# Altium schematic sheet EstmetSquematic.SchDoc
size A4
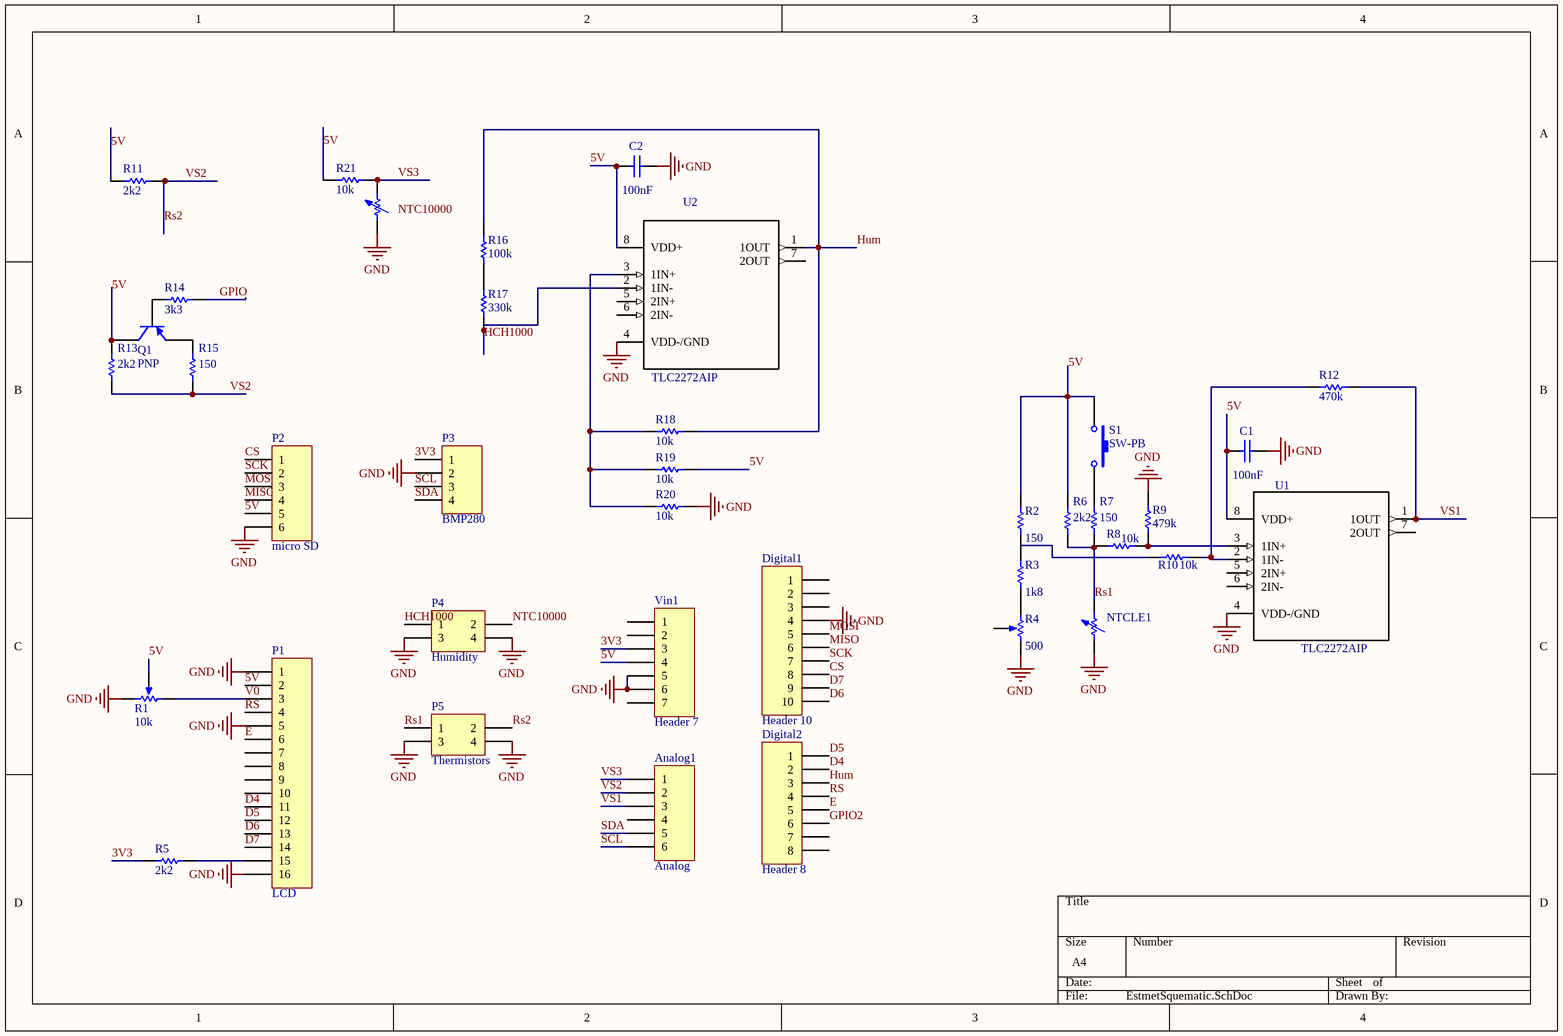
[diagram p0: EstmetSquematic.SchDoc]

## Parts
Analog1  Analog  [HDR1X6]
C1  value 100nF  [RAD-0.3]  (hidden comment: Cap)
C2  value 100nF  [RAD-0.3]  (hidden comment: Cap)
Digital1  Header 10  [HDR1X10]
Digital2  Header 8  [HDR1X8]
NTCLE  Res Adj1  [AXIAL-0.7]  (value not drawn)
NTCLE1  Res Adj1  [AXIAL-0.7]  (value not drawn)
P1  LCD  [HDR1X16]
P2  micro SD  [HDR1X6]
P3  BMP280  [HDR1X4]
P4  Humidity  [HDR2X2]
P5  Thermistors  [HDR2X2]
Q1  PNP  [SOT-23B_N]
R1  value 10k  [VR5]  (hidden comment: RPot)
R2  value 150  [AXIAL-0.3]  (hidden comment: Res1)
R3  value 1k8  [AXIAL-0.3]  (hidden comment: Res1)
R4  value 500  [VR5]  (hidden comment: RPot)
R5  value 2k2  [AXIAL-0.3]  (hidden comment: Res1)
R6  value 2k2  [AXIAL-0.3]  (hidden comment: Res1)
R7  value 150  [AXIAL-0.3]  (hidden comment: Res1)
R8  value 10k  [AXIAL-0.3]  (hidden comment: Res1)
R9  value 479k  [AXIAL-0.3]  (hidden comment: Res1)
R10  value 10k  [AXIAL-0.3]  (hidden comment: Res1)
R11  value 2k2  [AXIAL-0.3]  (hidden comment: Res1)
R12  value 470k  [AXIAL-0.3]  (hidden comment: Res1)
R13  value 2k2  [AXIAL-0.3]  (hidden comment: Res1)
R14  value 3k3  [AXIAL-0.3]  (hidden comment: Res1)
R15  value 150  [AXIAL-0.3]  (hidden comment: Res1)
R16  value 100k  [AXIAL-0.3]  (hidden comment: Res1)
R17  value 330k  [AXIAL-0.3]  (hidden comment: Res1)
R18  value 10k  [AXIAL-0.3]  (hidden comment: Res1)
R19  value 10k  [AXIAL-0.3]  (hidden comment: Res1)
R20  value 10k  [AXIAL-0.3]  (hidden comment: Res1)
R21  value 10k  [AXIAL-0.3]  (hidden comment: Res1)
S1  SW-PB  [SPST-2]
U1  TLC2272AIP  [*DIP254P762X508-8]
U2  TLC2272AIP  [*DIP254P762X508-8]
Vin1  Header 7  [HDR1X7]

## Nets
GND: C1.2 C2.2 Digital1.4 NTCLE.1 NTCLE1.1 P1.1 P1.5 P1.16 P2.6 P3.2 P4.3 P4.4 P5.3 P5.4 R1.2(BOT) R4.2(BOT) R9.1 R20.1 U1.4(VDD-/GND) U2.4(VDD-/GND) Vin1.5 Vin1.6
3V3: P3.1 R5.2 Vin1.3
5V: C1.1 C2.1 P1.2 P2.5 Q1.1(C) R1.3(TAP) R11.2 R13.2 R19.1 R21.2 U1.8(VDD+) U2.8(VDD+) Vin1.4
CS: Digital1.8 P2.1
D4: Digital2.2 P1.11
D5: Digital2.1 P1.12
D6: Digital1.10 P1.13
D7: Digital1.9 P1.14
E: Digital2.5 P1.6
GPIO: R14.1
GPIO2: Digital2.6
HCH1000: P4.1 R17.2 U2.2(1IN-)
Hum: Digital2.3 R16.1 R18.1 U2.1(1OUT)
MISO: Digital1.6 P2.4
MOSI: Digital1.5 P2.3
NTC10000: P4.2
RS: Digital2.4 P1.4
Rs1: NTCLE1.2 P5.1 R6.1 R7.1 R8.2
Rs2: Analog1.2 P5.2 R11.1 R13.1 R15.1  [also labelled VS2]
SCK: Digital1.7 P2.2
SCL: Analog1.6 P3.3
SDA: Analog1.5 P3.4
V0: P1.3 R1.1(TOP)
VS1: Analog1.3 R12.1 U1.1(1OUT)
VS3: Analog1.1 NTCLE.2 R21.1
NetP1_15: P1.15 R5.1
NetQ1_2: Q1.2(B) R14.2
NetQ1_3: Q1.3(E) R15.2
NetR2_1: R2.1 R3.2
NetR2_2: R2.2 R6.2 S1.1
NetR3_1: R3.1 R4.1(TOP)
NetR7_2: R7.2 S1.2
NetR8_1: R8.1 R9.2 U1.3(1IN+)
NetR10_1: R10.1 R12.2 U1.2(1IN-)
NetR16_2: R16.2 R17.1
NetR18_2: R18.2 R19.2 R20.2 U2.3(1IN+)

Not connected (* = marked no-connect by the designer): Analog1 4; Digital1 1 2 3; Digital2 7 8; P1 7 8 9 10; R4 3(TAP); R10 2; U1 5(2IN+) 6(2IN-) 7(2OUT); U2 5(2IN+) 6(2IN-) 7(2OUT); Vin1 1 2 7

## Notes on the sheet
- Labels drawn without touching a wire or pin: 5V, NTC10000

## Library data of the parts
Analog1 P2 = Header 6: Header, 6-Pin; LatestRevisionDate: 17-Jul-2002; LatestRevisionNote: Re-released for DXP Platform.; Publisher: Altium Limited
C1 C2 = Cap: Capacitor; Published: 8-Jun-2000; LatestRevisionDate: 17-Jul-2002; LatestRevisionNote: Re-released for DXP Platform.; PackageReference: RAD-0.3; Publisher: Altium Limited; PackageDescription: Radial Cap, Thru-Hole; 2 Leads; 0.3 in Pin Spacing
Digital1 = Header 10: Header, 10-Pin; LatestRevisionDate: 17-Jul-2002; LatestRevisionNote: Re-released for DXP Platform.; Publisher: Altium Limited
Digital2 = Header 8: Header, 8-Pin; LatestRevisionDate: 17-Jul-2002; LatestRevisionNote: Re-released for DXP Platform.; Publisher: Altium Limited
NTCLE NTCLE1 = Res Adj1: Variable Resistor; Value: 1K; Set Position: 0.5; Published: 8-Jun-2000; LatestRevisionDate: 17-Jul-2002; LatestRevisionNote: Re-released for DXP Platform.; PackageReference: AXIAL-0.7; Publisher: Altium Limited; PackageDescription: Axial Device, Thru-Hole; 2 Leads; 0.7 in Pin Spacing
P1 = Header 16: Header, 16-Pin; LatestRevisionDate: 17-Jul-2002; LatestRevisionNote: Re-released for DXP Platform.; Publisher: Altium Limited
P3 = Header 4: Header, 4-Pin; LatestRevisionDate: 17-Jul-2002; LatestRevisionNote: Re-released for DXP Platform.; Publisher: Altium Limited
P4 P5 = Header 2X2: Header, 2-Pin, Dual row; LatestRevisionDate: 17-Jul-2002; LatestRevisionNote: Re-released for DXP Platform.; Publisher: Altium Limited
Q1 = PNP: PNP Bipolar Transistor; Published: 8-Jun-2000; LatestRevisionDate: 29-May-2009; LatestRevisionNote: IPC-7351 Footprint Added.; PackageVersion: Aug-1999; PackageReference: SOT-23B; Publisher: Altium Limited; PackageDescription: 3-Pin SOT-23 Package 0.95 mm Pitch, 2.4 mm Lead Span
R1 R4 = RPot: Potentiometer; Sim Note: Enter the Resistance value and the set point into parameter fields.; Set Position: 0.5; Published: 8-Jun-2000; LatestRevisionDate: 17-Jul-2002; LatestRevisionNote: Re-released for DXP Platform.; PackageReference: VR5; Publisher: Altium Limited; PackageDescription: Variable Resistor, Thru-Hole; 3 Leads
R2 R3 R5-R21 = Res1: Resistor; Published: 8-Jun-2000; LatestRevisionDate: 17-Jul-2002; LatestRevisionNote: Re-released for DXP Platform.; PackageReference: AXIAL-0.3; Publisher: Altium Limited; PackageDescription: Axial Device, Thru-Hole; 2 Leads; 0.3 in Pin Spacing
S1 = SW-PB: Switch; Published: 24-Mar-1999; LatestRevisionDate: 17-Jul-2002; LatestRevisionNote: Re-released for DXP Platform.; PackageReference: SPST-2; Publisher: Altium Limited; PackageDescription: Switch; 2 Leads
U1 U2 = TLC2272AIP: Advanced LinCMOS_TM_ ail-To- ail Dual Operational Amplifier 8-PDIP; MF: Texas Instruments; MP: TLC2272AIP; Package: PDIP-8 Texas Instruments; Availability: Unavailable; Price: None; SnapEDA_Link: https://www.snapeda.com/parts/TLC2272AIP/Texas%20Instruments/view-part/?ref=snap; Value: *
Vin1 = Header 7: Header, 7-Pin; LatestRevisionDate: 17-Jul-2002; LatestRevisionNote: Re-released for DXP Platform.; Publisher: Altium Limited